# Altium schematic sheet LIDO-HW.002.RevisionHistory.SchDoc
size A3; CompanyName: EST-Floattech; DrawnBy: RR; Organization: EST-Floattech; Address2: Zandsteen 1; Address3: 2132 MZ; Address4: Hoofddorp; DocumentNumber: 21xxx; Revision: 1.0; SheetNumber: 2; SheetTotal: 17
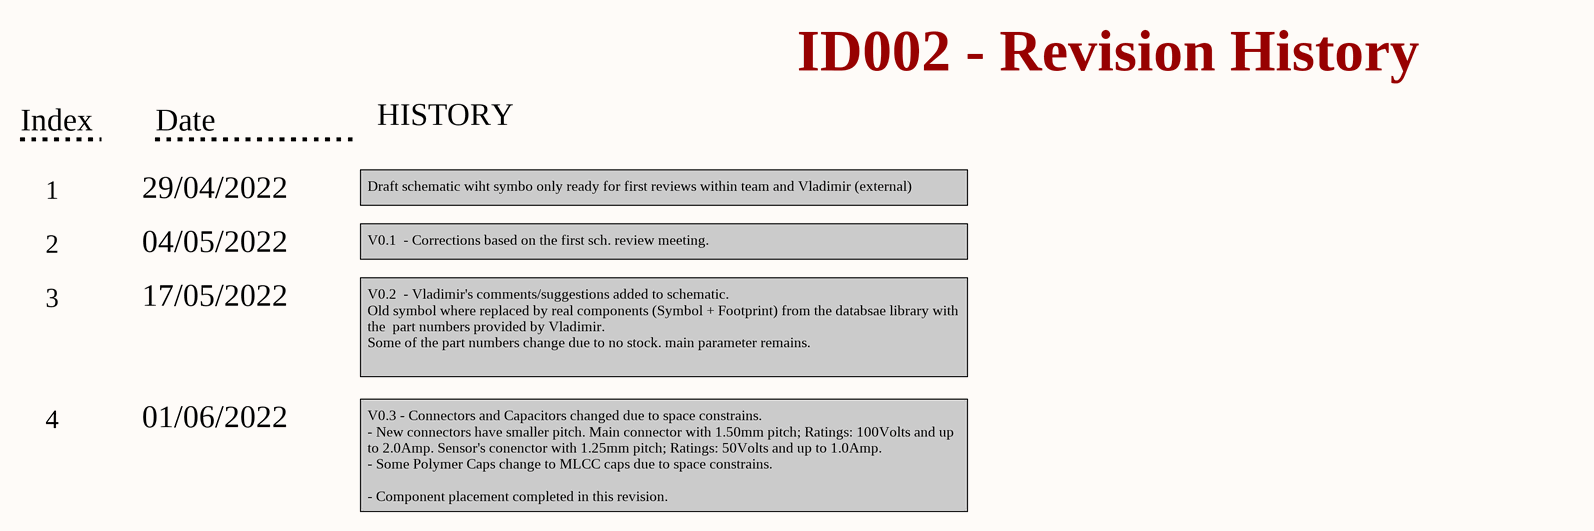
[diagram p0: LIDO-HW.002.RevisionHistory.SchDoc]

## Notes on the sheet
- Index
- Date
- HISTORY
- ID002 - Revision History
- 1
- 29/04/2022
- Draft schematic wiht symbo only ready for first reviews within team and Vladimir (external)
- 2
- 04/05/2022
- V0.1  - Corrections based on the first sch. review meeting.
- 3
- 17/05/2022
- V0.2  - Vladimir's comments/suggestions added to schematic.
  Old symbol where replaced by real components (Symbol + Footprint) from the databsae library with the  part numbers provided by Vladimir.
  Some of the part numbers change due to no stock. main parameter remains.
- 4
- 01/06/2022
- V0.3 - Connectors and Capacitors changed due to space constrains.
  - New connectors have smaller pitch. Main connector with 1.50mm pitch; Ratings: 100Volts and up to 2.0Amp. Sensor's conenctor with 1.25mm pitch; Ratings: 50Volts and up to 1.0Amp.
  - Some Polymer Caps change to MLCC caps due to space constrains.
  - Component placement completed in this revision.
- Title:
- Size:
- Date:
- A3
- Sheet       of
- Engineer:
- Version:
- Part Number:
- Revision:
- Rev. date:
- Project:
- File: